# Altium schematic sheet Sheet1.SchDoc
size A; SheetNumber: 1; SheetTotal: 1
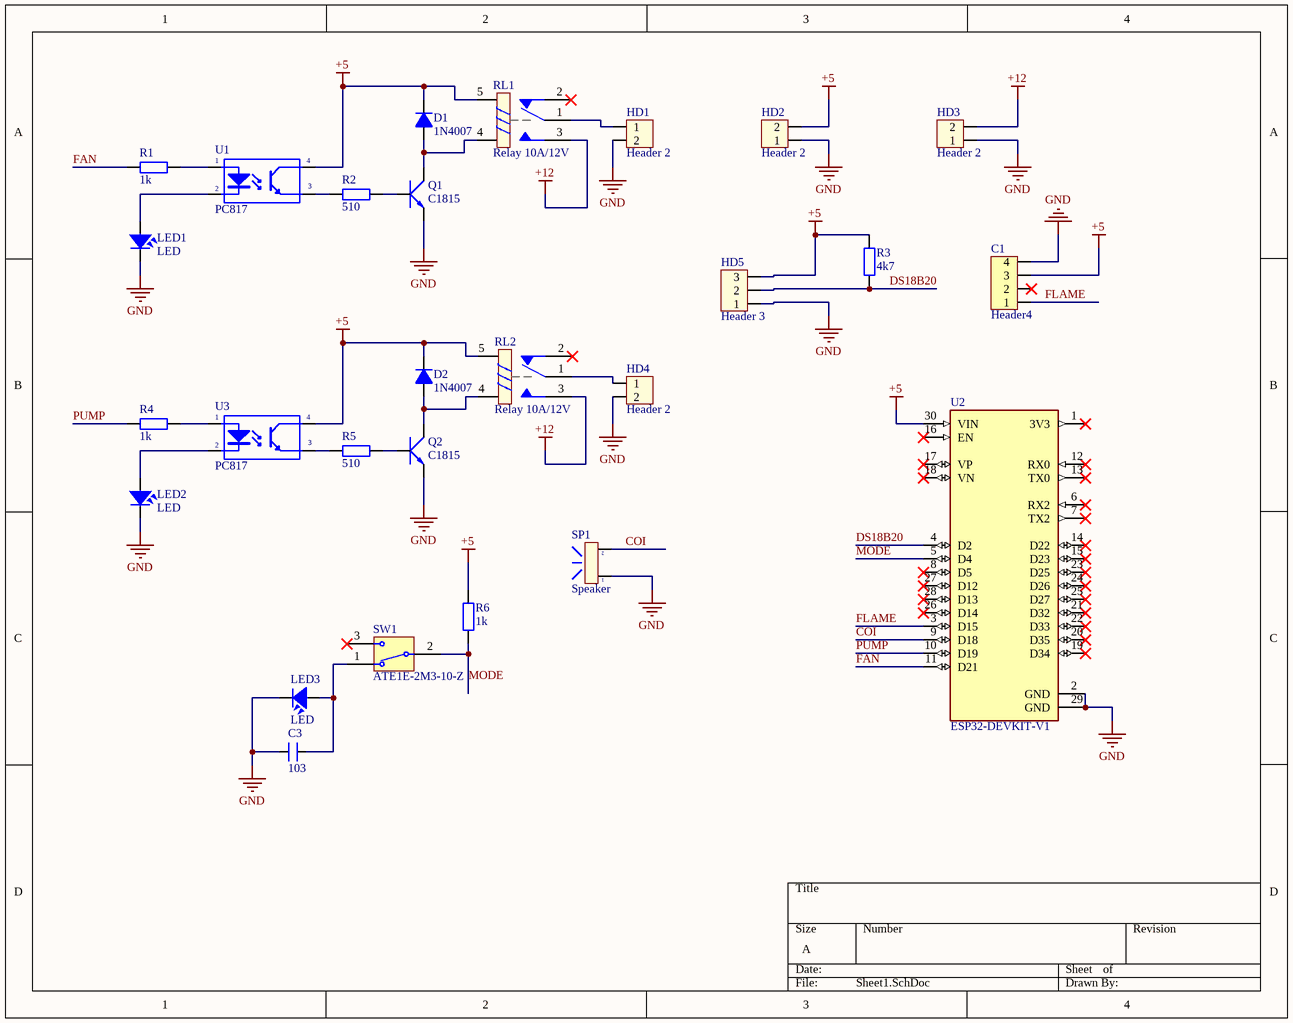
[diagram p0: Sheet1.SchDoc]

## Parts
C1  Header4  [Header4]
C3  103  [CN1.5]
D1  1N4007  [D1A]
D2  1N4007  [D1A]
HD1  Header 2  [HED2]
HD2  Header 2  [HED2]
HD3  Header 2  [HED2]
HD4  Header 2  [HED2]
HD5  Header 3  [HED3]
LED1  LED  [LED-3]
LED2  LED  [LED-3]
LED3  LED  [LED-3]
Q1  C1815  [QTO-92]
Q2  C1815  [QTO-92]
R1  1k  [R1/4W]
R2  510  [R1/4W]
R3  4k7  [R1/4W]
R4  1k  [R1/4W]
R5  510  [R1/4W]
R6  1k  [R1/4W]
RL1  Relay 10A/12V  [RL_SPDT_10A]
RL2  Relay 10A/12V  [RL_SPDT_10A]
SP1  Speaker  [SPK]
SW1  ATE1E-2M3-10-Z  [SW_TOGGLE_ATE1E-2M3-10-Z]
U1  PC817  [DIP4/W0.3]
U2  ESP32-DEVKIT-V1  [MODULE_ESP32_DEVKIT_V1]
U3  PC817  [DIP4/W0.3]

## Nets
+5: C1.3 D1.2(K) D2.2(K) HD2.2 HD5.3 R3.2 R6.2 RL1.5 RL2.5 U1.4(C) U2.30(VIN) U3.4(C)
+12: HD3.2 RL1.3 RL2.3
GND: C1.4 C3.1 HD1.2 HD2.1 HD3.1 HD4.2 HD5.1 LED1.2 LED2.2 LED3.2 Q1.1(E) Q2.1(E) SP1.1 U2.2(GND) U2.29(GND)
COI: SP1.2 U2.9(D18)
DS18B20: HD5.2 R3.1 U2.4(D2)
FAN: R1.1 U2.11(D21)
FLAME: C1.1 U2.3(D15)
MODE: R6.1 SW1.2(COM) U2.5(D4)
PUMP: R4.1 U2.10(D19)
NetC3_2: C3.2 LED3.1 SW1.1(NC)
NetD1_1: D1.1(A) Q1.2(C) RL1.4
NetD2_1: D2.1(A) Q2.2(C) RL2.4
NetHD1_1: HD1.1 RL1.1
NetHD4_1: HD4.1 RL2.1
NetLED1_1: LED1.1 U1.2(K)
NetLED2_1: LED2.1 U3.2(K)
NetQ1_3: Q1.3(B) R2.2
NetQ2_3: Q2.3(B) R5.2
NetR1_2: R1.2 U1.1(A)
NetR2_1: R2.1 U1.3(E)
NetR4_2: R4.2 U3.1(A)
NetR5_1: R5.1 U3.3(E)

Not connected (* = marked no-connect by the designer): C1 2*; RL1 2*; RL2 2*; SW1 3(NO)*; U2 1(3V3)* 6(RX2)* 7(TX2)* 8(D5)* 12(RX0)* 13(TX0)* 14(D22)* 15(D23)* 16(EN)* 17(VP)* 18(VN)* 19(D34)* 20(D35)* 21(D32)* 22(D33)* 23(D25)* 24(D26)* 25(D27)* 26(D14)* 27(D12)* 28(D13)*

## Library data of the parts
C1 = Header4: Header IDC, 4 x 1 Pin Vertical 2.54mm Pitch (Non-Boxed, Male); Manufacturer: W¨¹rth Elektronik eiSos GmbH; partNo: 613002143121; ComponentLink1 Description: Manufacturer; ComponentLink2 Description: Datasheet; NoPins: 02; Created Date: 29 March 2013; ComponentLink1URL: http://www.we-online.com; ComponentLink2URL: http://katalog.we-online.de/em/datasheet/6130xx143121.pdf; Created by: Karrer Zheng
C3 = CN1.5: Cap np 682pF => 104pF; Value: 0.01uF
D1 D2 = D1A: Diode 1A; Value: 1N4007
HD1-HD4 = Hed2: Header 2 (Green); Value: Header 2
HD5 = Hed3: Header 3 (Green); Value: Header 3
LED1-LED3 = LED: LED Single colour Green and Red; Value: LED 3 ly Single Colour
Q1 Q2 = C1815: NPN 600mW, ECB; Value: C1815
R1-R6 = R1/4W: Resistor 1/4W; Value: R1/4W - 1K
RL1 RL2 = Relay 1: Relay SPDT,10A - 12VDC 5 Pin; Value: Relay SPDT, 10A, 12V
SP1 = SPK: Speaker Chip; Value: Speaker Chip
SW1 = SW_TOGGLE_ATE1E-2M3-10-Z: SWITCH TOGGLE SPDT 50MA 48V; Manufacturer: Copal Electronics Inc.; Switch Function: On-Off-On; Current Rating: 50mA (AC/DC); Actuator Type: Standard Round; Actuator Length: 6.00mm; Illumination: Non-Illuminated; Bushing Thread: Unthreaded; Electrical Life: 50,000 Cycles; Supplier 1: Digi-Key; Manufacturer Part Number: ATE1E-2M3-10-Z; RoHS: RoHS Compliant; Category: Switches; Stock 1: 3693; Pricing 1: 1=2.87, 10=2.752, 25=2.6324, 50=2.5126, 100=2.2733, 250=2.0938, 500=1.91434, 1000=1.67504, 5000=1.61522 (USD); Packaging: Bulk; Part Status: Active; Circuit: SPDT; Voltage Rating - AC: 48V; Voltage Rating - DC: 48V; Illumination Type, Color: -; Illumination Voltage (Nominal): -; Mounting Type: Through Hole; Termination Style: PC Pin; Panel Cutout Dimensions: -; Ingress Protection: -; Features: Washable; Actuator Material: -; Operating Temperature: -20°C ~ 85°C; ComponentLink1URL: https://www.nidec-copal-electronics.com/e/catalog/switch/ate.pdf; ComponentLink1Description: https://www.nidec-copal-electronics.com/e/catalog/switch/ate.pdf; Supplier Part Number 1: 563-1159-ND
U1 U3 = PC817: Single Opto; Value: PC817
U2 = ESP32-DEVKIT-V1: Dual core, Wi-Fi: 2.4 GHz up to 150 Mbits/s,BLE (Bluetooth Low Energy) and legacy Bluetooth, 32 bits, Up to 240 MHz; MF: Do it; Value: *; MP: ESP32-DEVKIT-V1; SnapEDA_Link: https://www.snapeda.com/parts/ESP32-DEVKIT-V1/Do+it/view-part/?ref=snap; Price: None; Package: None; Check_prices: https://www.snapeda.com/parts/ESP32-DEVKIT-V1/Do+it/view-part/?ref=eda; Availability: Not in stock